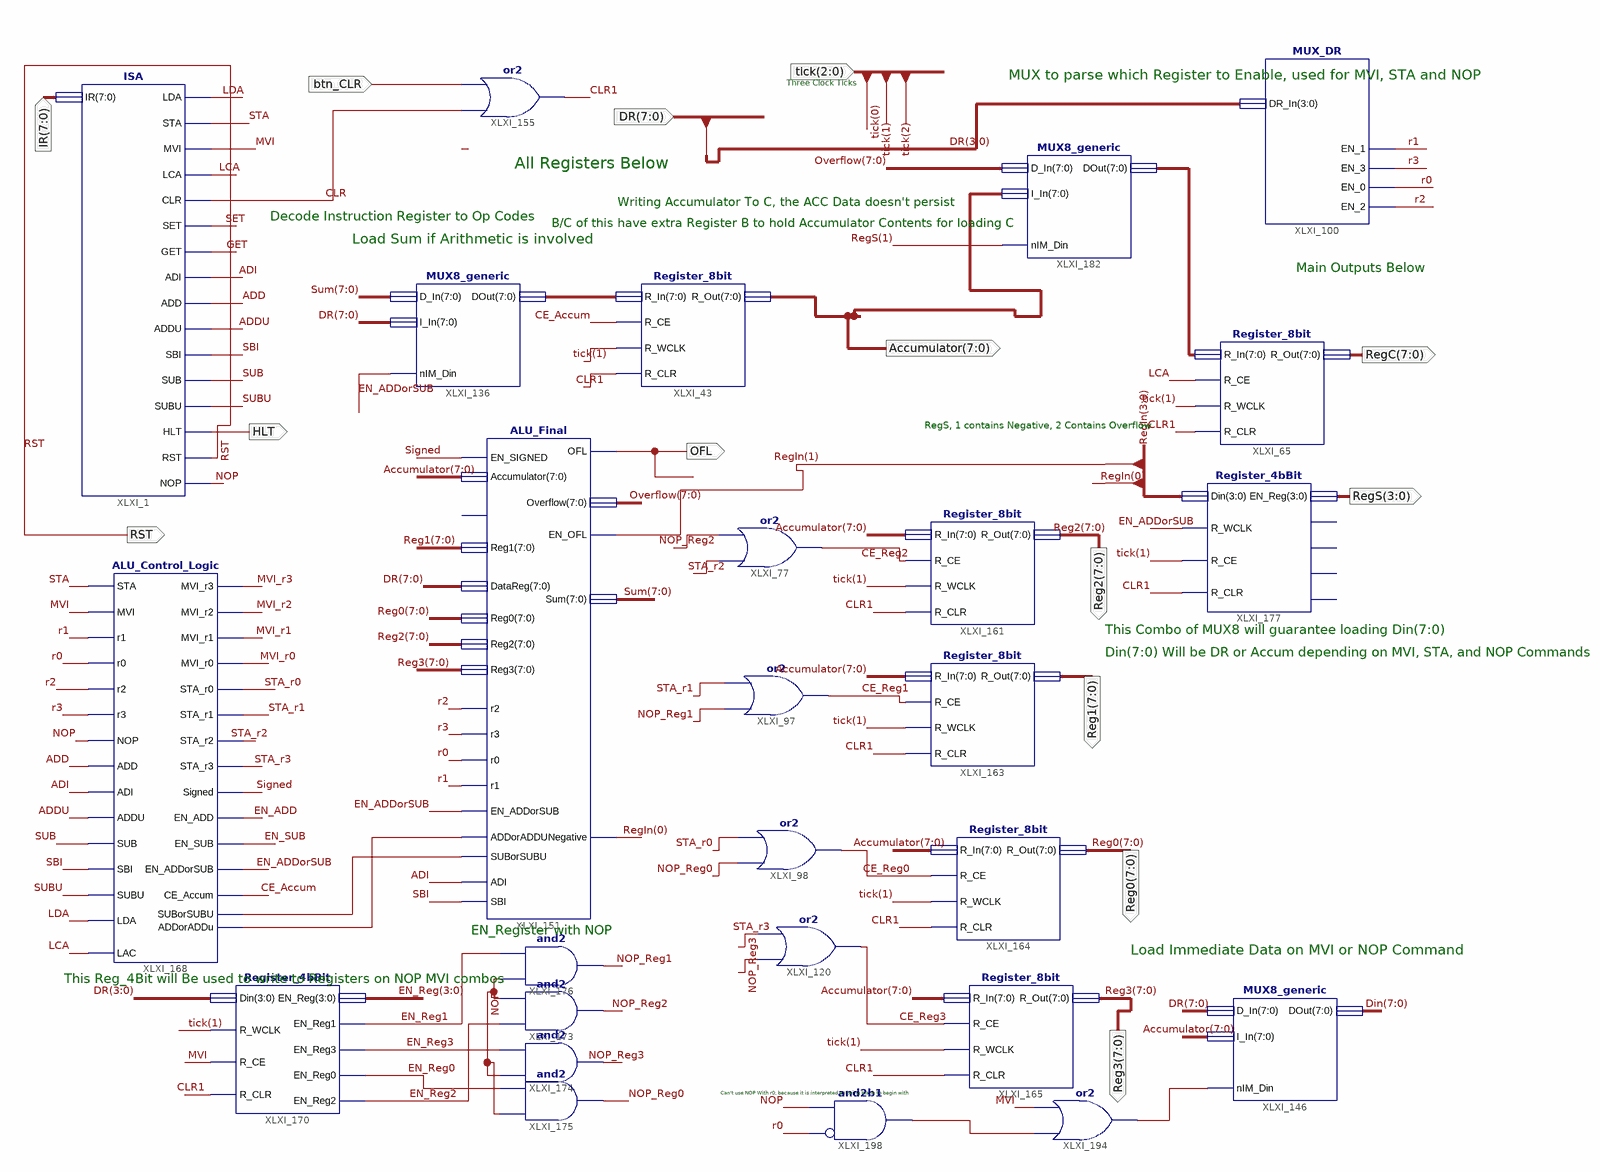
[diagram p0: schematic sheet 1]
// Xilinx ISE schematic ProgramGround.sch (spartan3e) as structural Verilog: 26 symbols, 14 ports
module ProgramGround (
  input  [7:0] DR,
  input  [7:0] IR,
  input  btn_CLR,
  input  [2:0] tick,
  output [7:0] Accumulator,
  output [7:0] Reg1,
  output [7:0] Reg3,
  output OFL,
  output [7:0] Reg2,
  output [7:0] Reg0,
  output [7:0] RegC,
  output HLT,
  output RST,
  output [3:0] RegS
);

  wire ADD, ADDU, ADI, CE_Accum, CE_Reg0, CE_Reg1, CE_Reg2, CE_Reg3, CLR, CLR1, EN_ADD, EN_ADDorSUB, EN_Reg0,
       EN_Reg1, EN_Reg2, EN_Reg3, EN_SUB, GET, LCA, LDA, MVI, MVI_r0, MVI_r1, MVI_r2, MVI_r3, NOP, NOP_Reg0,
       NOP_Reg1, NOP_Reg2, NOP_Reg3, r0, r1, r2, r3, SBI, SET, Signed, STA, STA_r0, STA_r1, STA_r2, STA_r3,
       SUB, SUBU, XLXN_475, XLXN_476, XLXN_555, XLXN_564;
  wire [3:0] EN_Reg, RegIn;
  wire [7:0] Din, Overflow, Sum, XLXN_499, XLXN_545;

  Register_8bit XLXI_65 (.R_In(XLXN_499), .R_CE(LCA), .R_WCLK(tick[1]), .R_CLR(CLR1), .R_Out(RegC));
  or XLXI_77 (CE_Reg2, STA_r2, NOP_Reg2);
  ISA XLXI_1 (
    .IR(IR), .LDA(LDA), .STA(STA), .MVI(MVI), .LCA(LCA), .CLR(CLR), .SET(SET), .GET(GET), .ADI(ADI),
    .ADD(ADD), .ADDU(ADDU), .SBI(SBI), .SUB(SUB), .SUBU(SUBU), .HLT(HLT), .RST(RST), .NOP(NOP));
  or XLXI_97 (CE_Reg1, NOP_Reg1, STA_r1);
  or XLXI_98 (CE_Reg0, NOP_Reg0, STA_r0);
  or XLXI_120 (CE_Reg3, NOP_Reg3, STA_r3);
  MUX8_generic XLXI_146 (.D_In(DR), .I_In(Accumulator), .DOut(Din), .nIM_Din(XLXN_555));
  ALU_Final XLXI_151 (
    .Accumulator(Accumulator), .EN_SIGNED(Signed), .Reg1(Reg1), .DataReg(DR), .EN_ADDorSUB(EN_ADDorSUB),
    .Reg0(Reg0), .Reg2(Reg2), .Reg3(Reg3), .ADDorADDU(XLXN_476), .SUBorSUBU(XLXN_475), .ADI(ADI), .SBI(SBI),
    .r3(r3), .r0(r0), .r1(r1), .r2(r2), .Negative(RegIn[0]), .Sum(Sum), .OFL(OFL), .Overflow(Overflow),
    .EN_OFL(RegIn[1]));  // open: nADD_SUB
  or XLXI_155 (CLR1, CLR, btn_CLR);
  Register_8bit XLXI_161 (.R_In(Accumulator), .R_CE(CE_Reg2), .R_WCLK(tick[1]), .R_CLR(CLR1), .R_Out(Reg2));
  Register_8bit XLXI_163 (.R_In(Accumulator), .R_CE(CE_Reg1), .R_WCLK(tick[1]), .R_CLR(CLR1), .R_Out(Reg1));
  Register_8bit XLXI_164 (.R_In(Accumulator), .R_CE(CE_Reg0), .R_WCLK(tick[1]), .R_CLR(CLR1), .R_Out(Reg0));
  Register_8bit XLXI_165 (.R_In(Accumulator), .R_CE(CE_Reg3), .R_WCLK(tick[1]), .R_CLR(CLR1), .R_Out(Reg3));
  ALU_Control_Logic XLXI_168 (
    .STA(STA), .MVI(MVI), .r1(r1), .r0(r0), .r2(r2), .r3(r3), .NOP(NOP), .ADD(ADD), .ADI(ADI), .ADDU(ADDU),
    .SUB(SUB), .SBI(SBI), .SUBU(SUBU), .LDA(LDA), .MVI_r3(MVI_r3), .MVI_r2(MVI_r2), .MVI_r1(MVI_r1),
    .MVI_r0(MVI_r0), .STA_r0(STA_r0), .STA_r1(STA_r1), .STA_r2(STA_r2), .STA_r3(STA_r3), .Signed(Signed),
    .EN_ADD(EN_ADD), .EN_SUB(EN_SUB), .EN_ADDorSUB(EN_ADDorSUB), .SUBorSUBU(XLXN_475), .ADDorADDu(XLXN_476),
    .CE_Accum(CE_Accum), .LAC(LCA));
  Register_4bBit XLXI_170 (
    .Din(DR[3:0]), .R_WCLK(tick[1]), .R_CE(MVI), .R_CLR(CLR1), .EN_Reg(EN_Reg), .EN_Reg1(EN_Reg1),
    .EN_Reg3(EN_Reg3), .EN_Reg0(EN_Reg0), .EN_Reg2(EN_Reg2));
  and XLXI_173 (NOP_Reg2, EN_Reg2, NOP);
  and XLXI_174 (NOP_Reg3, NOP, EN_Reg3);
  and XLXI_175 (NOP_Reg0, NOP, EN_Reg0);
  and XLXI_176 (NOP_Reg1, NOP, EN_Reg1);
  Register_4bBit XLXI_177 (
    .Din(RegIn), .R_WCLK(EN_ADDorSUB), .R_CE(tick[1]), .R_CLR(CLR1), .EN_Reg(RegS));  // open: EN_Reg1, EN_Reg3, EN_Reg0, EN_Reg2
  MUX_DR XLXI_100 (.DR_In(DR[3:0]), .EN_1(r1), .EN_3(r3), .EN_0(r0), .EN_2(r2));
  MUX8_generic XLXI_182 (.D_In(Overflow), .I_In(Accumulator), .DOut(XLXN_499), .nIM_Din(RegS[1]));
  Register_8bit XLXI_43 (.R_In(XLXN_545), .R_CE(CE_Accum), .R_WCLK(tick[1]), .R_CLR(CLR1), .R_Out(Accumulator));
  MUX8_generic XLXI_136 (.D_In(Sum), .I_In(DR), .DOut(XLXN_545), .nIM_Din(EN_ADDorSUB));
  or XLXI_194 (XLXN_555, XLXN_564, MVI);
  and XLXI_198 (XLXN_564, ~r0, NOP);  // and2b1

  // Notes on the sheet:
  //   MUX to parse which Register to Enable, used for MVI, STA and NOP
  //   Three Clock Ticks
  //   All Registers Below
  //   Writing Accumulator To C, the ACC Data doesn't persist
  //   Decode Instruction Register to Op Codes
  //   B/C of this have extra Register B to hold Accumulator Contents for loading C
  //   Load Sum if Arithmetic is involved
  //   Main Outputs Below
  //   RegS, 1 contains Negative, 2 Contains Overflow
  //   This Combo of MUX8 will guarantee loading Din(7:0)
  //   Din(7:0) Will be DR or Accum depending on MVI, STA, and NOP Commands
  //   EN_Register with NOP
  //   Load Immediate Data on MVI or NOP Command
  //   This Reg_4Bit will Be used to write to Registers on NOP MVI combos
  //   Can't use NOP With r0, because it is interpreted as being blank to begin with
endmodule
